# Altium schematic sheet Micromouse_Altium_v4.SchDoc
size A
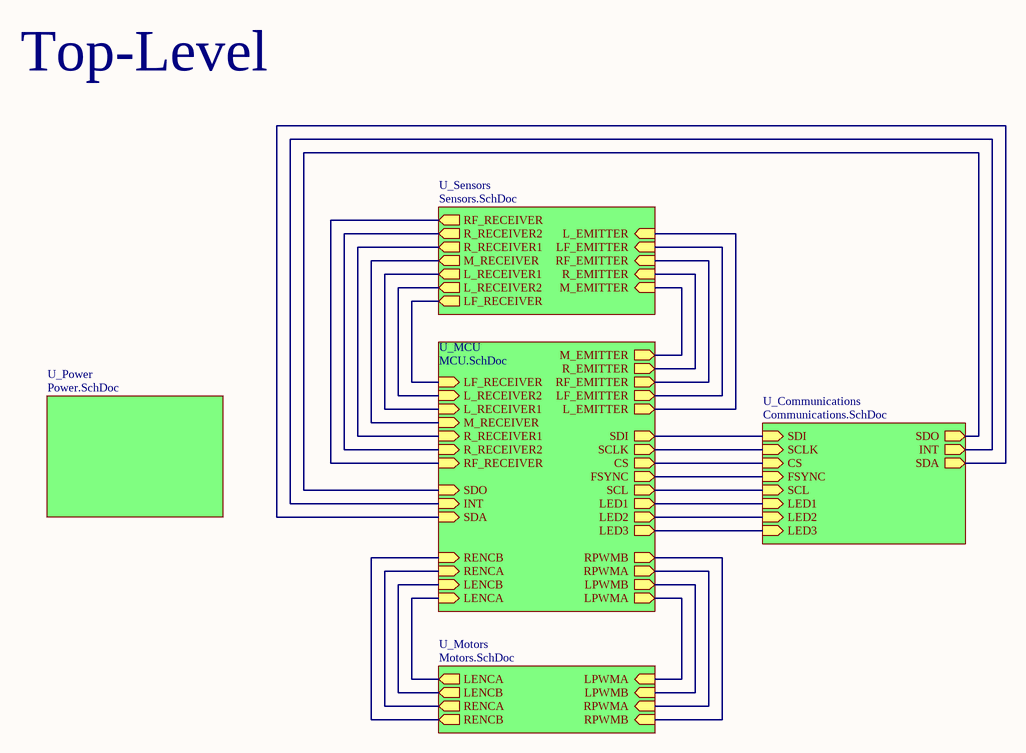
[diagram p0: Micromouse_Altium_v4.SchDoc]

## Sub-sheets
U_Communications = Communications.SchDoc: SDI (in), SCLK (in), CS (in), SDO (out), INT (out), FSYNC (in), SDA (out), SCL (in), LED1 (in), LED2 (in), LED3 (in)
U_MCU = MCU.SchDoc: SDI (out), SDO (in), SCLK (out), CS (out), FSYNC (out), INT (in), SCL (out), SDA (in), LENCA (in), LENCB (in), RENCA (in), RENCB (in), LPWMA (out), LPWMB (out), L_EMITTER (out), LF_EMITTER (out), M_EMITTER (out), R_EMITTER (out), RF_EMITTER (out), L_RECEIVER1 (in), L_RECEIVER2 (in), LF_RECEIVER (in), R_RECEIVER1 (in), R_RECEIVER2 (in), RF_RECEIVER (in), M_RECEIVER (in), RPWMA (out), RPWMB (out), LED1 (out), LED2 (out), LED3 (out)
U_Motors = Motors.SchDoc: LPWMA (in), LPWMB (in), LENCA (out), LENCB (out), RPWMA (in), RPWMB (in), RENCA (out), RENCB (out)
U_Power = Power.SchDoc: no entries
U_Sensors = Sensors.SchDoc: L_EMITTER (in), LF_EMITTER (in), RF_EMITTER (in), R_EMITTER (in), M_EMITTER (in), RF_RECEIVER (out), R_RECEIVER2 (out), R_RECEIVER1 (out), M_RECEIVER (out), L_RECEIVER1 (out), L_RECEIVER2 (out), LF_RECEIVER (out)

## Nets
(unnamed): sheet U_Motors/LPWMA, sheet U_MCU/LPWMA
(unnamed): sheet U_Motors/LPWMB, sheet U_MCU/LPWMB
(unnamed): sheet U_Motors/LENCA, sheet U_MCU/LENCA
(unnamed): sheet U_Motors/LENCB, sheet U_MCU/LENCB
(unnamed): sheet U_Motors/RPWMA, sheet U_MCU/RPWMA
(unnamed): sheet U_Motors/RPWMB, sheet U_MCU/RPWMB
(unnamed): sheet U_Motors/RENCA, sheet U_MCU/RENCA
(unnamed): sheet U_Motors/RENCB, sheet U_MCU/RENCB
(unnamed): sheet U_Sensors/L_EMITTER, sheet U_MCU/L_EMITTER
(unnamed): sheet U_Sensors/LF_EMITTER, sheet U_MCU/LF_EMITTER
(unnamed): sheet U_Sensors/RF_EMITTER, sheet U_MCU/RF_EMITTER
(unnamed): sheet U_Sensors/R_EMITTER, sheet U_MCU/R_EMITTER
(unnamed): sheet U_Sensors/M_EMITTER, sheet U_MCU/M_EMITTER
(unnamed): sheet U_Sensors/RF_RECEIVER, sheet U_MCU/RF_RECEIVER
(unnamed): sheet U_Sensors/R_RECEIVER2, sheet U_MCU/R_RECEIVER2
(unnamed): sheet U_Sensors/R_RECEIVER1, sheet U_MCU/R_RECEIVER1
(unnamed): sheet U_Sensors/M_RECEIVER, sheet U_MCU/M_RECEIVER
(unnamed): sheet U_Sensors/L_RECEIVER1, sheet U_MCU/L_RECEIVER1
(unnamed): sheet U_Sensors/L_RECEIVER2, sheet U_MCU/L_RECEIVER2
(unnamed): sheet U_Sensors/LF_RECEIVER, sheet U_MCU/LF_RECEIVER
(unnamed): sheet U_MCU/SDI, sheet U_Communications/SDI
(unnamed): sheet U_MCU/SDO, sheet U_Communications/SDO
(unnamed): sheet U_MCU/SCLK, sheet U_Communications/SCLK
(unnamed): sheet U_MCU/CS, sheet U_Communications/CS
(unnamed): sheet U_MCU/FSYNC, sheet U_Communications/FSYNC
(unnamed): sheet U_MCU/INT, sheet U_Communications/INT
(unnamed): sheet U_MCU/SCL, sheet U_Communications/SCL
(unnamed): sheet U_MCU/SDA, sheet U_Communications/SDA
(unnamed): sheet U_MCU/LED1, sheet U_Communications/LED1
(unnamed): sheet U_MCU/LED2, sheet U_Communications/LED2
(unnamed): sheet U_MCU/LED3, sheet U_Communications/LED3

## Notes on the sheet
- Top-Level